# EAGLE design house_exterior_board (EAGLE 7.0.0)
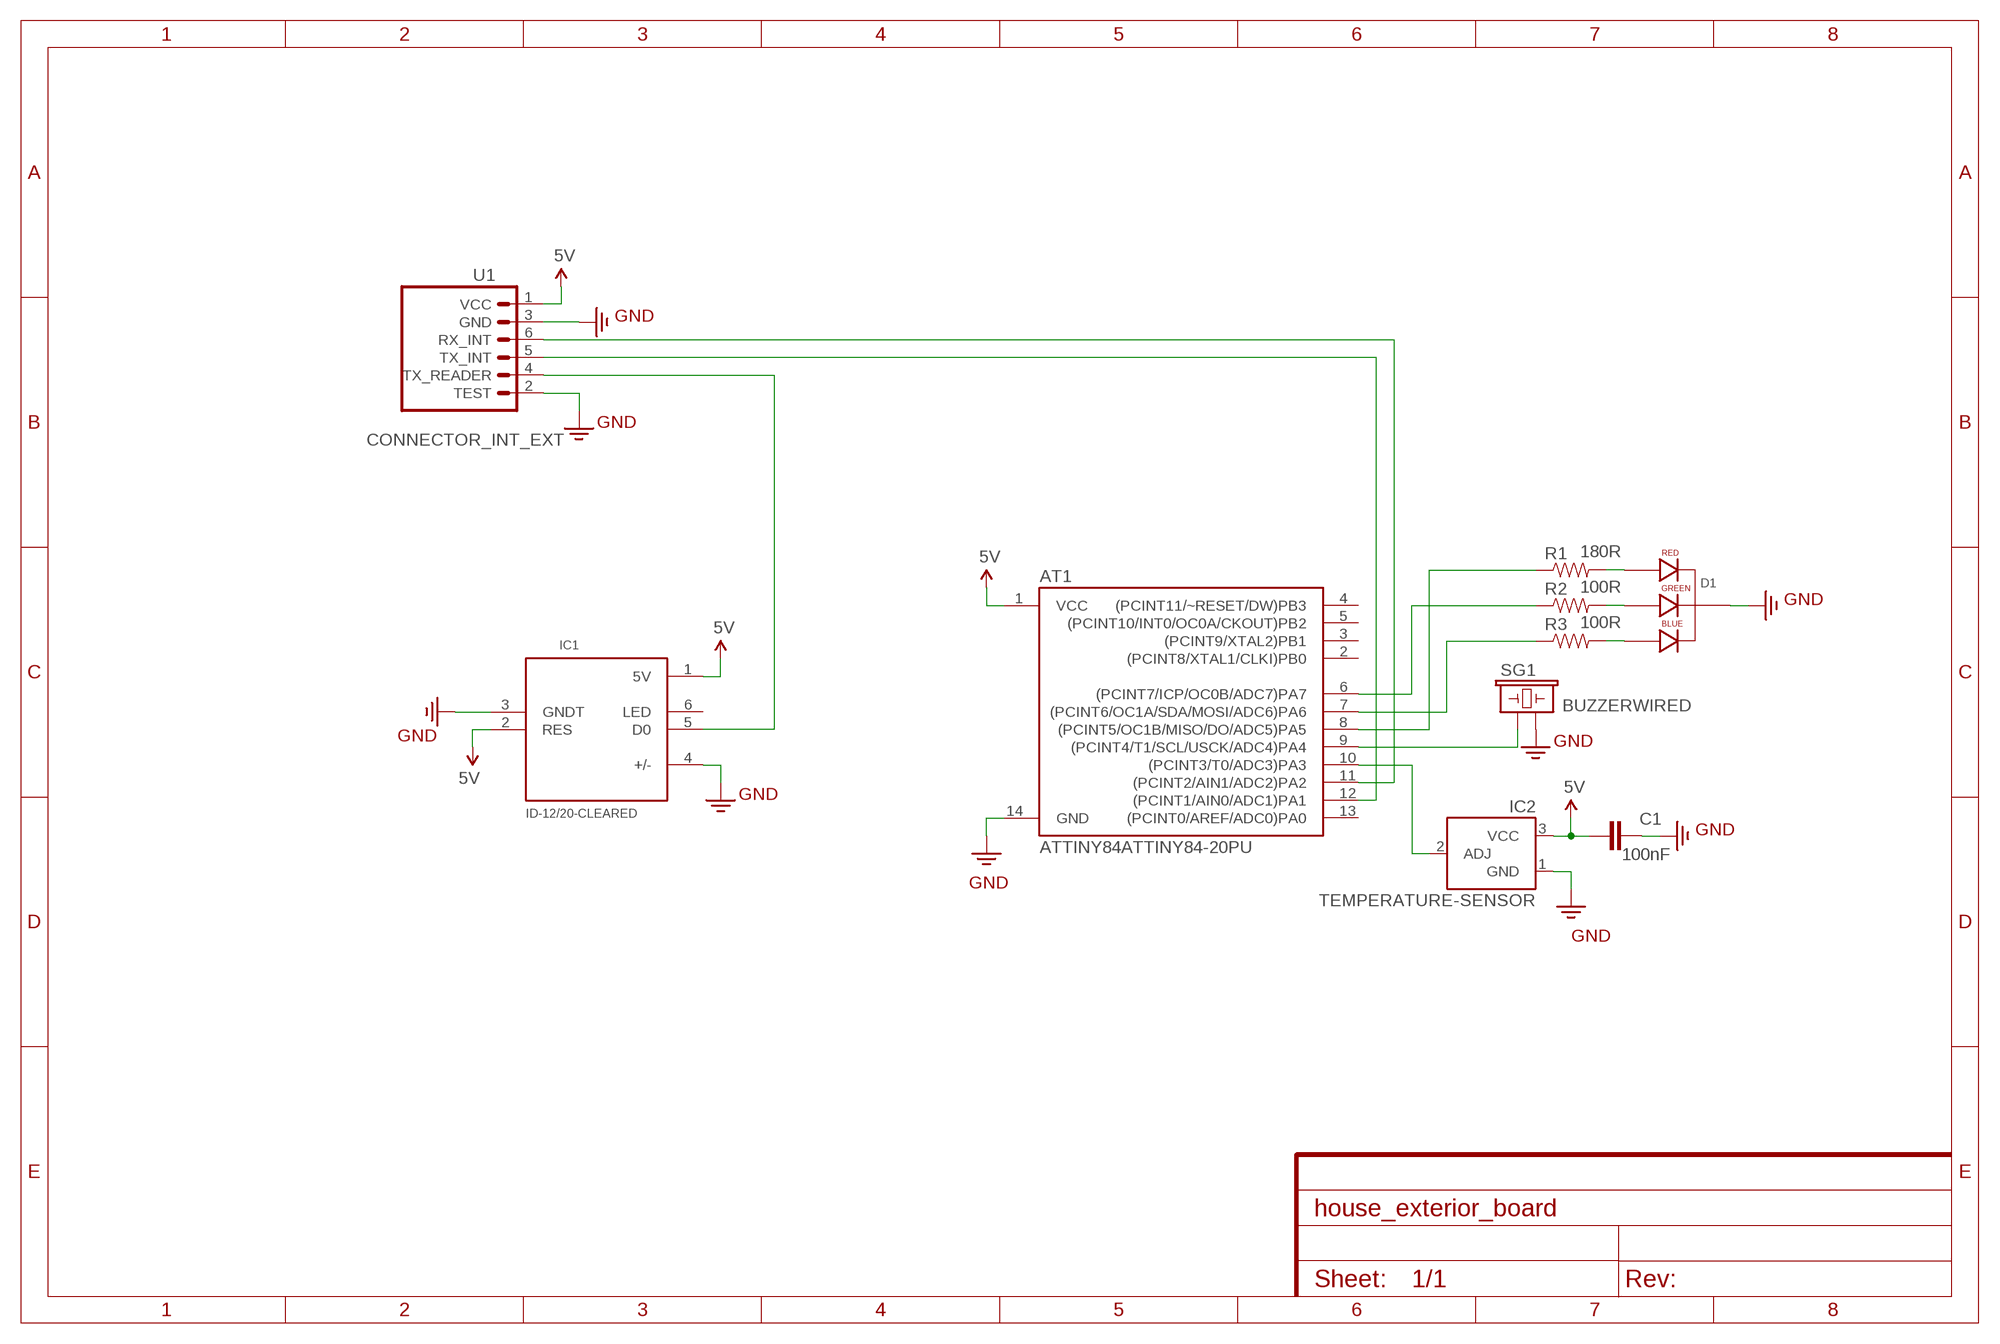
[diagram p0: schematic, sheet 1]
FRAME1 (FRAME-A4L): CNAME: RFID READER SCHEMATICS; CREVISION: 1.0; DESIGNER: nerdvellous

## Parts
AT1  ATTINY84ATTINY84-20PU  [DIL14]
C1  100nF  0.1UF-50V-20%(PTH)KIT-EZ  [CAP-PTH-SMALL-KIT]
D1  LED-RGB-CC-THRUCLEAR  [LED-RGB-THRU]
IC1  ID-12/20-CLEARED  [1X06_COMMON]
IC2  TEMPERATURE-SENSOR  [TO-92]
R1  180R  RESISTORVERT  [AXIAL-0.1]
R2  100R  RESISTORVERT  [AXIAL-0.1]
R3  100R  RESISTORVERT  [AXIAL-0.1]
SG1  BUZZERWIRED  [1X02]
U1  CONNECTOR_INT_EXT  [1X06_COMMON]

## Nets
5V: AT1.1(VCC) C1.1 IC1.1(5V) IC1.2(RES) IC2.3(VCC) U1.1(VCC)
GND: AT1.14(GND) C1.2 D1.2(CATHODE) IC1.3(GNDT) IC1.4(+/-) IC2.1(GND) SG1.2 U1.2(TEST) U1.3(GND)
N$1: D1.1(RED_CATHODE) R1.P$2
N$2: D1.3(GREEN_CATHODE) R2.P$2
N$3: D1.4(BLUE_CATHODE) R3.P$2
N$4: AT1.10((PCINT3/T0/ADC3)PA3) IC2.2(ADJ)
N$5: AT1.7((PCINT6/OC1A/SDA/MOSI/ADC6)PA6) R3.P$1
N$6: AT1.8((PCINT5/OC1B/MISO/DO/ADC5)PA5) R1.P$1
N$7: AT1.6((PCINT7/ICP/OC0B/ADC7)PA7) R2.P$1
N$8: AT1.9((PCINT4/T1/SCL/USCK/ADC4)PA4) SG1.1
N$9: AT1.11((PCINT2/AIN1/ADC2)PA2) U1.6(RX_INT)
N$10: AT1.12((PCINT1/AIN0/ADC1)PA1) U1.5(TX_INT)
N$11: IC1.5(D0) U1.4(TX_READER)
Unconnected: AT1.2((PCINT8/XTAL1/CLKI)PB0) AT1.3((PCINT9/XTAL2)PB1) AT1.4((PCINT11/~RESET/DW)PB3) AT1.5((PCINT10/INT0/OC0A/CKOUT)PB2) AT1.13((PCINT0/AREF/ADC0)PA0) IC1.6(LED)

## Library data of the parts
AT1 = nerdvellous_house_manager:ATTINY84: Atmel 14-pin 2/4/8kB flash uC
C1 = nerdvellous_house_manager:0.1UF-50V-20%(PTH): CAP-08370; PROD_ID: CAP-08370
D1 = nerdvellous_house_manager:LED-RGB-CC-THRU: RGB Through-hole common cathode LED SparkFun Storefront: COM-00105 (Clear) COM-09264 (Diffuse); PROD_ID: DIO-08418
IC1 = nerdvellous_house_manager:ID-12/20-CLEARED: RFID reader for ID2, ID12, and ID20 Package
IC2 = nerdvellous_house_manager:TEMPERATURE-SENSOR: TO-92 temp sensor
R1-R3 = nerdvellous_house_manager:RESISTOR: Resistor Basic schematic elements and footprints for 0603, 1206, and PTH resistors.
SG1 = nerdvellous_house_manager:BUZZER: Buzzer 12mm Spark Fun Electronics SKU : Comp-Buzzer
U1 = nerdvellous_house_manager:CONNECTOR_INT_EXT

## Board
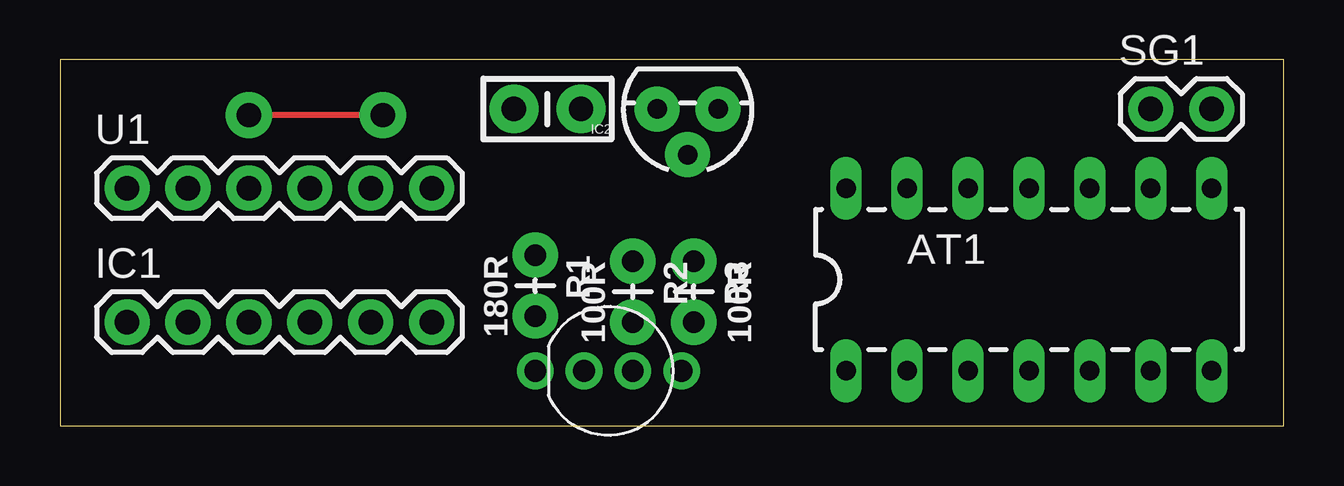
[diagram p1: board, top side]
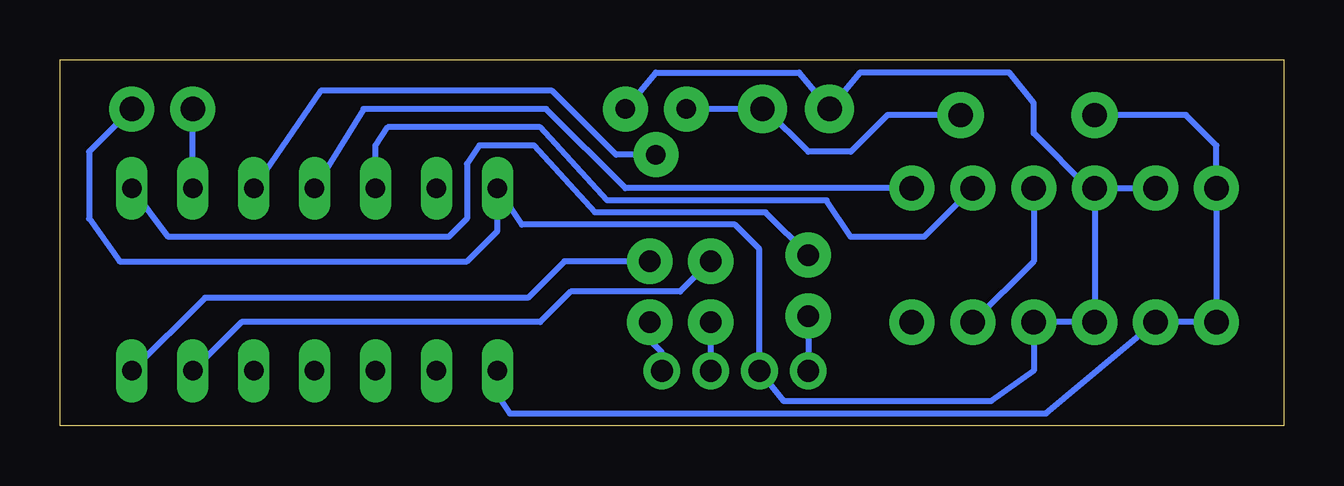
[diagram p2: board, bottom side, seen from below]

Size 51 x 15.25 mm. Coordinates in mm from the lower left corner, seen from the top.
Outline: 0,0 51,0 51,15.25 0,15.25 0,0
Copper layers (1*16): Top 0.035mm / dielectric 1.5mm / Bottom 0.035mm
Design rules "default": minimum track width 10mil, minimum drill 24mil, track to track 8mil, track to pad 8mil, pad to pad 8mil, via to via 8mil, smd to smd 8mil, copper to edge 40mil, drill to drill 8mil, minimum pad ring 10mil, minimum via ring 8mil, stop-mask expansion 4mil, vias tented up to drill 0mil, thermal gap 10mil

### Footprints (pad centres in the part's own frame; a part is rotated, then mirrored left to right if it is on the bottom)
DIL14 = drill 0.813 long: 1 -8.89,-3.81; 2 -6.35,-3.81; 3 -3.81,-3.81; 4 -1.27,-3.81; 5 1.27,-3.81; 6 3.81,-3.81; 7 6.35,-3.81; 8 6.35,3.81; 9 3.81,3.81; 10 1.27,3.81; 11 -1.27,3.81; 12 -3.81,3.81; 13 -6.35,3.81; 14 -8.89,3.81
CAP-PTH-SMALL-KIT = drill 1.016 pad 2.032: 1 -1.397,0; 2 1.397,0
LED-RGB-THRU = drill 0.9 pad 1.524: 1 3.048,0; 2 1.016,0; 3 -1.016,0; 4 -3.048,0
1X06_COMMON = drill 1.016 pad 1.88: 1 0,0; 2 2.54,0; 3 5.08,0; 4 7.62,0; 5 10.16,0; 6 12.7,0
TO-92 = drill 0.813 pad 1.88: 1 -1.27,0; 2 0,1.905; 3 1.27,0
AXIAL-0.1 = drill 0.9 pad 1.88: P$1 0,0; P$2 2.54,0
1X02 = drill 1.016 pad 1.88: 1 0,0; 2 2.54,0

### Placement (x,y rotation side)
AT1  41.66,6.1 0 top
C1  20.32,13.21 180 top
D1  22.86,2.29 180 top
IC1  2.79,4.32 0 top
IC2  26.16,13.21 180 top
R1  19.81,7.11 270 top
R2  23.88,6.86 270 top
R3  26.42,6.86 270 top
SG1  45.47,13.21 0 top
U1  2.79,9.91 0 top

### Tracks (layer width: path | path; a pad name or v marks a point on that pad's centre or on a via)
5V  (via drill 1.02 pad 1.93)
  Top 0.254: v13.46,12.95 v7.87,12.95
  Bottom 0.254: IC2.3 C1.1 21.59,13.21 19.81,11.43 18.03,11.43 16.51,12.95 v13.46,12.95 | AT1.1 32.77,1.27 32.26,0.51 9.91,0.51 IC1.2 IC1.1 U1.1 2.79,11.68 4.06,12.95 v7.87,12.95
GND
  Bottom 0.254: U1.3 U1.2 | U1.3 IC1.3 IC1.4 10.41,2.29 12.19,1.02 20.83,1.02 D1.2 21.84,7.37 22.86,8.38 31.75,8.38 AT1.14 32.77,8.13 34.04,6.86 48.51,6.86 49.78,8.64 49.78,11.43 SG1.2 | IC2.1 26.16,14.73 20.19,14.73 C1.2 17.65,14.73 11.43,14.73 10.41,13.46 10.41,12.19 8.13,9.91 U1.3
N$1
  Bottom 0.254: R1.P$2 D1.1
N$2
  Bottom 0.254: R2.P$2 D1.3
N$3
  Bottom 0.254: R3.P$2 26.42,3.56 25.91,3.05 D1.4
N$4
  Bottom 0.254: IC2.2 27.81,11.3 30.48,13.97 40.13,13.97 AT1.10
N$5
  Bottom 0.254: R3.P$1 29.97,6.86 31.5,5.33 44.96,5.33 AT1.7
N$6
  Bottom 0.254: R1.P$1 21.59,8.89 28.7,8.89 31.24,11.68 33.53,11.68 34.04,10.92 34.04,8.64 34.8,7.87 46.48,7.87 AT1.8
N$7
  Bottom 0.254: R2.P$1 25.15,5.59 29.72,5.59 30.99,4.32 43.43,4.32 AT1.6
N$8
  Bottom 0.254: AT1.9 SG1.1
N$9
  Bottom 0.254: U1.6 27.43,9.91 30.73,13.21 38.35,13.21 AT1.11
N$10
  Bottom 0.254: U1.5 14.99,7.87 18.03,7.87 19.05,9.4 28.19,9.4 30.99,12.45 37.34,12.45 37.85,11.68 AT1.12
N$11
  Bottom 0.254: U1.4 10.41,6.86 IC1.5